# EAGLE schematic servoUART by Raspberry Pi3 (EAGLE 8.2.2)
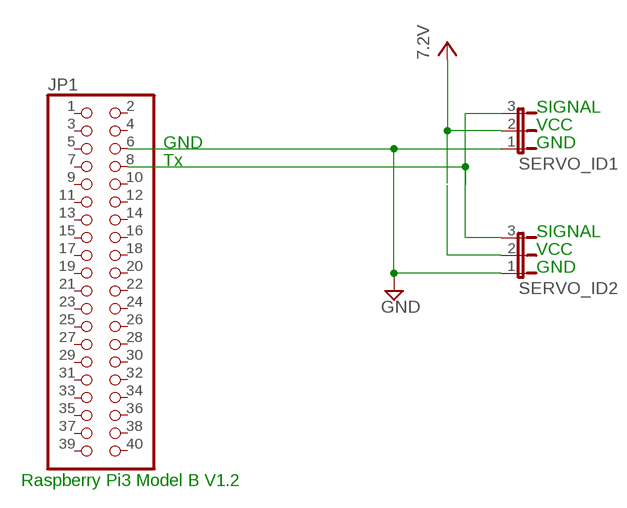
[diagram p0: schematic, sheet 1]

## Parts
JP1  PINHD-2X20  [2X20]
SERVO_ID1  JP2E  [JP2]
SERVO_ID2  JP2E  [JP2]

## Nets
GND: JP1.6 SERVO_ID1.1 SERVO_ID2.1
N$1: SERVO_ID1.3
N$2: SERVO_ID2.2
N$6: JP1.8 SERVO_ID2.3
VCC: SERVO_ID1.2 ; supply symbol labelled 7.2V
Unconnected: JP1.1 JP1.2 JP1.3 JP1.4 JP1.5 JP1.7 JP1.9 JP1.10 JP1.11 JP1.12 JP1.13 JP1.14 JP1.15 JP1.16 JP1.17 JP1.18 JP1.19 JP1.20 JP1.21 JP1.22 JP1.23 JP1.24 JP1.25 JP1.26 JP1.27 JP1.28 JP1.29 JP1.30 JP1.31 JP1.32 JP1.33 JP1.34 JP1.35 JP1.36 JP1.37 JP1.38 JP1.39 JP1.40

## Notes on the sheet
- SIGNAL
- VCC
- GND | GND
- Tx
- SIGNAL
- VCC
- GND
- Raspberry Pi3 Model B V1.2

## Library data of the parts
JP1 = adafruit:PINHD-2X20: PIN HEADER
SERVO_ID1 SERVO_ID2 = jumper:JP2E: JUMPER